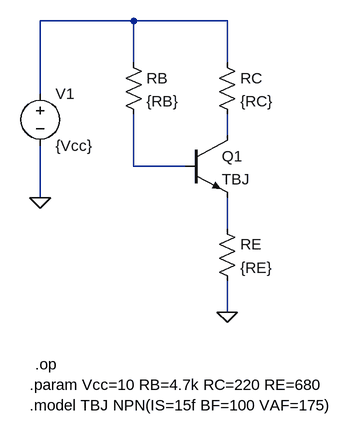
[diagram p0: schematic Q04 - Questão 2.asc]
Q04 - Questão 2.asc, the LTspice schematic file:
Version 4
SHEET 1 880 680
WIRE 240 -48 96 -48
WIRE 384 -48 240 -48
WIRE 240 16 240 -48
WIRE 384 16 384 -48
WIRE 96 64 96 -48
WIRE 384 128 384 96
WIRE 240 176 240 96
WIRE 320 176 240 176
WIRE 96 224 96 144
WIRE 384 272 384 224
WIRE 384 400 384 352
FLAG 384 400 0
FLAG 96 224 0
SYMBOL voltage 96 48 R0
SYMATTR InstName V1
SYMATTR Value {Vcc}
SYMBOL npn 320 128 R0
SYMATTR InstName Q1
SYMATTR Value TBJ
SYMBOL res 224 0 R0
SYMATTR InstName RB
SYMATTR Value {RB}
SYMBOL res 368 0 R0
SYMATTR InstName RC
SYMATTR Value {RC}
SYMBOL res 368 256 R0
SYMATTR InstName RE
SYMATTR Value {RE}
TEXT 88 480 Left 2 !.op
TEXT 80 512 Left 2 !.param Vcc=10 RB=4.7k RC=220 RE=680\n.model TBJ NPN(IS=15f BF=100 VAF=175)

The netlist it stands for:
* Q04 - Questão 2.asc
V1 N001 0 {Vcc}
Q1 N002 N003 N004 0 TBJ
RB N001 N003 {RB}
RC N001 N002 {RC}
RE N004 0 {RE}
.model NPN NPN
.model PNP PNP
.lib standard.bjt
.op
.param Vcc=10 RB=4.7k RC=220 RE=680
.model TBJ NPN(IS=15f BF=100 VAF=175)
.backanno
.end